# Altium schematic sheet RxFrontendWaveyRadar.SchDoc: Rx Frontend WaveyRadar Schematic
size Letter; Author: Will Vu; CompanyName: Raccoon Wireless; DrawnBy: Will Vu, Raccoon Wireless; Engineer: Will Vu; Organization: Raccoon Wireless; DocumentNumber: 2-12; Revision: 2; SheetNumber: 12; SheetTotal: 15
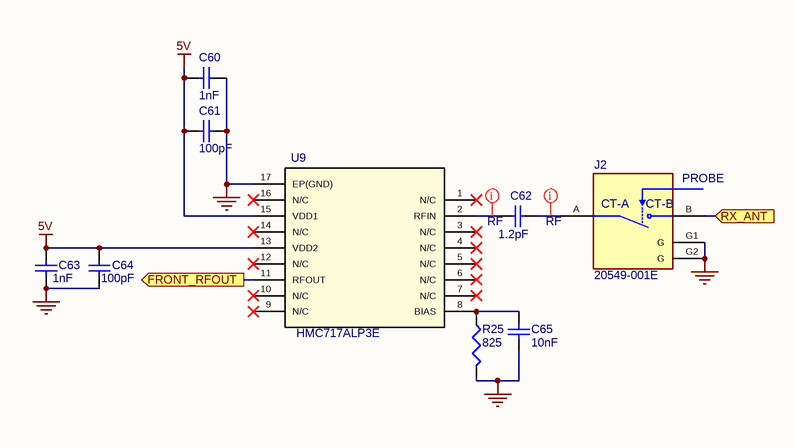
[diagram p0: RxFrontendWaveyRadar.SchDoc]

## Parts
C60  value 1nF  [CAPC0402(1005)33_L]  (hidden comment: Capacitor 1nF +/-20% 50V 0402)
C61  value 100pF  [CAPC1005X56X25LL10T15]  (hidden comment: 04023A101JAT2A)
C62  value 1.2pF  [FP-C0402-BB-MFG]  (hidden comment: C0402C129C5GACTU)
C63  value 1nF  [CAPC0402(1005)33_L]  (hidden comment: Capacitor 1nF +/-20% 50V 0402)
C64  value 100pF  [CAPC1005X56X25LL10T15]  (hidden comment: 04023A101JAT2A)
C65  value 10nF  [CAPC0402(1005)60_L]  (hidden comment: Capacitor 10nF +/-20% 50V 0402)
J2  20549-001E  [IPEX_20549-001E]
R25  value 825  [RESC1005X40X25NL05T05]  (hidden comment: CRCW0402825RFKED)
U9  HMC717ALP3E  [HCP_16_3]

## Ports
FRONT_RFOUT (out), RX_ANT (in)

## Nets
5V: C60.2 C61.2 C63.2 C64.2 U9.13(VDD2) U9.15(VDD1)
GND: C60.1 C61.1 C63.1 C64.1 C65.2 J2.G1(G) J2.G2(G) R25.2 U9.17(EP(GND))
FRONT_RFOUT: U9.11(RFOUT) ; port FRONT_RFOUT
RX_ANT: J2.B(CT-B) ; port RX_ANT
NetC62_1: C62.1 U9.2(RFIN)
NetC62_2: C62.2 J2.A(CT-A)
NetC65_1: C65.1 R25.1 U9.8(BIAS)

Not connected (* = marked no-connect by the designer): U9 1(N/C)* 3(N/C)* 4(N/C)* 5(N/C)* 6(N/C)* 7(N/C)* 9(N/C)* 10(N/C)* 12(N/C)* 14(N/C)* 16(N/C)*

## Layout directives
net class RF: NetC62_1, NetC62_2

## Notes on the sheet
- /
- (in symbol CMP-044-000000-6) PROBE

## Library data of the parts
C60 C63 = CMP-001-00066-4: Chip Capacitor, 1nF +/-20%, 50V, 0402, Thickness 0.33 mm; Tolerance: 10%; Case/Package: 0402; Max Operating Temperature: 85°C; Min Operating Temperature: -55°C; Mounting Technology: SMT; Voltage Rating: 50V; Pins: 2
C61 C64 = CMP-001-00083-2: AVX - 04023A101JAT2A - SMD Multilayer Ceramic Capacitor, 100 pF, 25 V, 0402 [1005 Metric], ± 5%, C0G / NP0, AVX 0402 MLCC
C62 = CMP-001-00085-1: Cap Ceramic 1.2pF 50V C0G 0.25pF SMD 0402 125°C Paper T/R
C65 = CMP-001-00069-4: Chip Capacitor, 10nF +/-20%, 50V, 0402, Thickness 0.6 mm; Tolerance: 5%; Max Operating Temperature: 85°C; Voltage Rating: 50V; Case/Package: 0402; Pins: 2; Min Operating Temperature: -55°C; Mounting Technology: SMT
J2 = CMP-044-000000-6: 1 POS Vertical SMD Coaxial RF switch connector with a 2.3 x 2.3 mm footprint and support to 11 GHz, MHC; MF: I-PEX; Source: 20549-001E.SchLib; SnapEDA_Link: https://www.snapeda.com/parts/20549-001E/I-PEX/view-part/3220455/?ref=snap; Value: *; Design Item ID: 20549-001E; Package: None; Check_prices: https://www.snapeda.com/parts/20549-001E/I-PEX/view-part/3220455/?ref=eda; Price: None; Availability: Warning; MP: 20549-001E
R25 = CMP-009-00194-1: Resistor;  Thick Film;  825 Ohms;  0.063 W;  1%;  SMT;  0402;  TCR 37 ppm/DegC;  Cut Tape
U9 = CMP-026-000000-4: No Description Available; RefDes: RefDes; Type: DEV; Source: 2021-06-01_15-55-40.SchLib; Copyright: Copyright (C) 2018 Accelerated Designs. All rights reserved; Design Item ID: HMC717ALP3E